# Altium schematic sheet Sheet1 - Copy.SchDoc
size A1
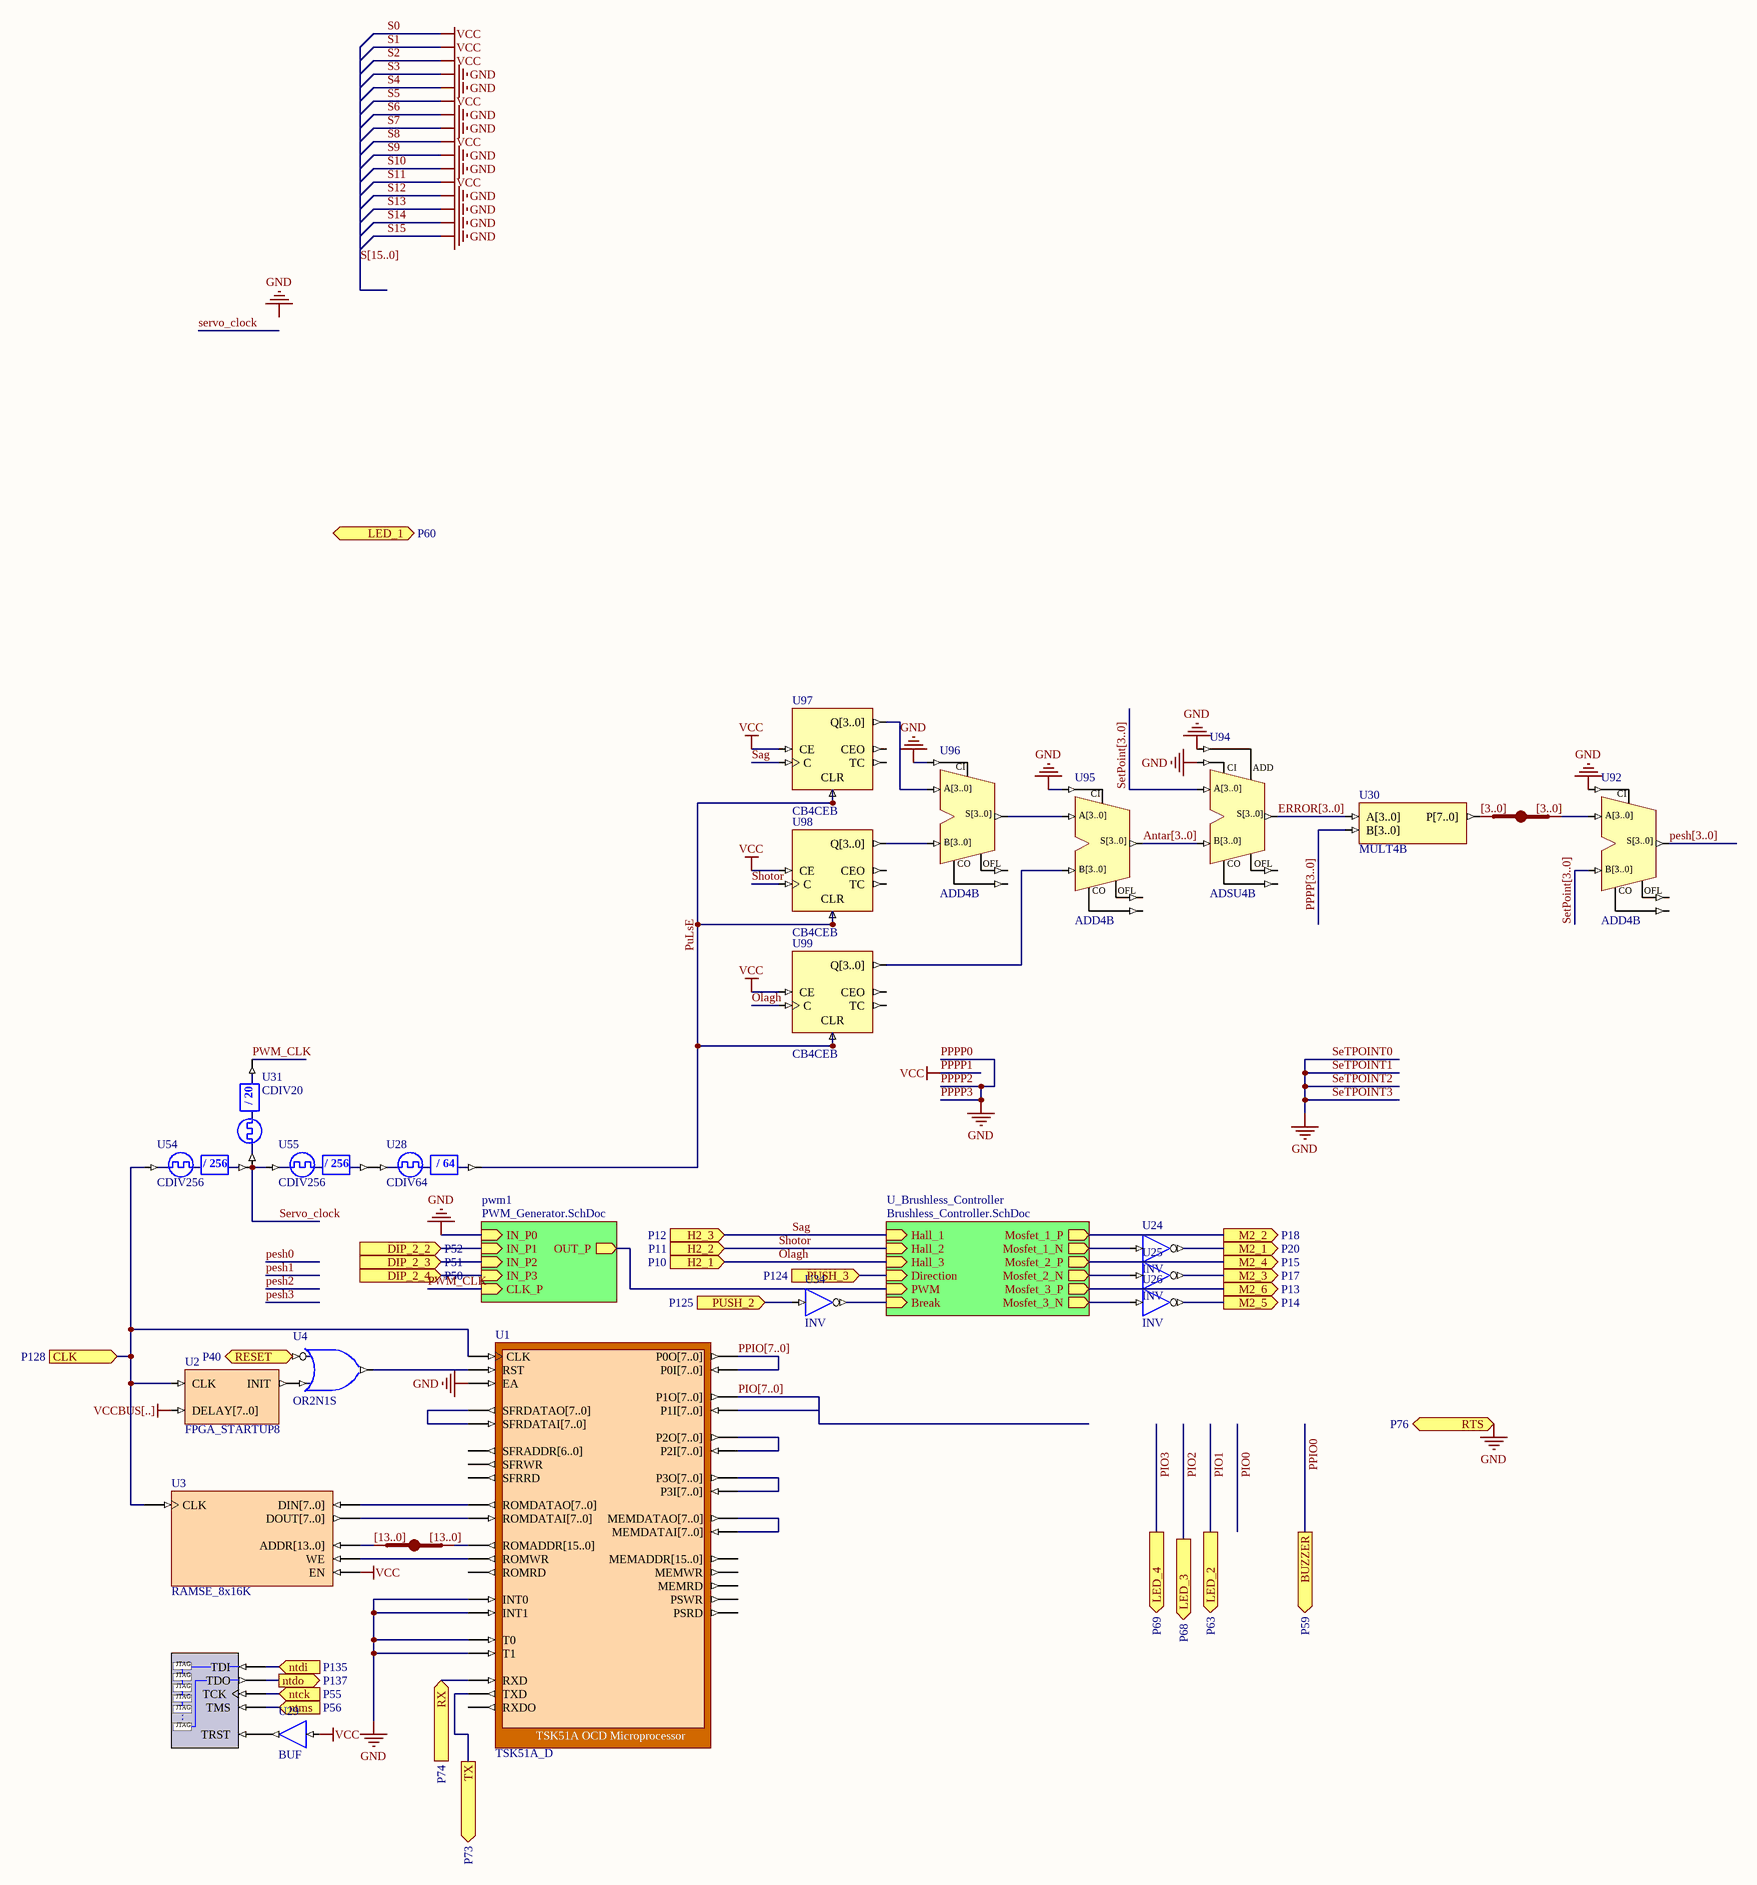
[diagram p0: Sheet1 - Copy.SchDoc]

## Parts
(Parts that share a designator on the sheet are numbered #1, #2 ... from top to bottom, then left to right.)
JB_AUTO?#1  IndexA: [3..0]  (hidden comment: JB)
JB_AUTO?#2  IndexA: [13..0]  (hidden comment: JB)
NEXUS_JTAG_PORT  NEXUS_JTAG_PORT  (value not drawn)
U1  TSK51A_D
U2  FPGA_STARTUP8
U3  RAMSE_8x16K
U4  OR2N1S
U24  INV
U25  INV
U26  INV
U28  CDIV64
U29  BUF
U30  MULT4B
U31  CDIV20
U34  INV
U54  CDIV256
U55  CDIV256
U92  ADD4B
U94  ADSU4B
U95  ADD4B
U96  ADD4B
U97  CB4CEB
U98  CB4CEB
U99  CB4CEB

## Sub-sheets
pwm1 = PWM_Generator.SchDoc: IN_P0 (in), IN_P1 (in), IN_P2 (in), IN_P3 (in), OUT_P (out), CLK_P (in)
U_Brushless_Controller = Brushless_Controller.SchDoc: Hall_1 (in), Hall_2 (in), Hall_3 (in), Direction (in), PWM (in), Mosfet_1_P (out), Mosfet_1_N (out), Mosfet_2_P (out), Mosfet_2_N (out), Mosfet_3_P (out), Mosfet_3_N (out), Break (in)

## Ports
BUZZER (out, see P59), CLK (in, see P128), DIP_2_2 (in, see P52), DIP_2_3 (in, see P51), DIP_2_4 (in, see P50), H2_1 (in, see P10), H2_2 (in, see P11), H2_3 (in, see P12), LED_1 (out, see P60), LED_2 (out, see P63), LED_3 (out, see P68), LED_4 (out, see P69), M2_1 (out, see P20), M2_2 (out, see P18), M2_3 (out, see P17), M2_4 (out, see P15), M2_5 (out, see P14), M2_6 (out, see P13), ntck (in, see P55), ntdi (in, see P135), ntdo (out, see P137), ntms (in, see P56), PUSH_2 (in, see P125), PUSH_3 (in, see P124), RESET (in, see P40), RTS (out, see P76), RX (in, see P74), TX (out, see P73)

## Nets
PPPP0: U1.EA U1.INT0 U1.INT1 U1.T0 U1.T1 U92.CI U94.ADD U94.CI U95.CI U96.CI ; port RTS, sheet pwm1/IN_P0  [also labelled GND, PPPP2, PPPP3, S10, S12, S13, S14, S15, S3, S4, S6, S7, S9, SeTPOINT0, SeTPOINT1, SeTPOINT2, SeTPOINT3]
PPPP1: U3.EN U29.I U97.CE U98.CE U99.CE  [also labelled S0, S1, S11, S2, S5, S8, VCC]
VCCBUS[..]: U2.DELAY[7..0]
Antar[3..0]: U94.B[3..0] U95.S[3..0]
CLK: U1.CLK U2.CLK U3.CLK U54.CLKIN ; port CLK
DIP_2_2: port DIP_2_2, sheet pwm1/IN_P1
DIP_2_3: port DIP_2_3, sheet pwm1/IN_P2
DIP_2_4: port DIP_2_4, sheet pwm1/IN_P3
ERROR[3..0]: U30.A[3..0] U94.S[3..0]
M2_1: U24.O ; port M2_1
M2_2: port M2_2, sheet U_Brushless_Controller/Mosfet_1_P
M2_3: U25.O ; port M2_3
M2_4: port M2_4, sheet U_Brushless_Controller/Mosfet_2_P
M2_5: U26.O ; port M2_5
M2_6: port M2_6, sheet U_Brushless_Controller/Mosfet_3_P
ntck: NEXUS_JTAG_PORT.TCK ; port ntck
ntdi: NEXUS_JTAG_PORT.TDI ; port ntdi
ntdo: NEXUS_JTAG_PORT.TDO ; port ntdo
ntms: NEXUS_JTAG_PORT.TMS ; port ntms
Olagh: U99.C ; port H2_1, sheet U_Brushless_Controller/Hall_3
pesh[3..0]: U92.S[3..0]
PIO1: port LED_2
PIO2: port LED_3
PIO3: port LED_4
PIO[7..0]: U1.P1I[7..0] U1.P1O[7..0]
PPIO0: port BUZZER
PPIO[7..0]: U1.P0I[7..0] U1.P0O[7..0]
PPPP[3..0]: U30.B[3..0]
PuLsE: U28.CLKDV U97.CLR U98.CLR U99.CLR
PUSH_2: U34.I ; port PUSH_2
PUSH_3: port PUSH_3, sheet U_Brushless_Controller/Direction
PWM_CLK: U31.CLKDV ; sheet pwm1/CLK_P
RESET: U4.I0 ; port RESET
RX: U1.RXD ; port RX
Sag: U97.C ; port H2_3, sheet U_Brushless_Controller/Hall_1
Servo_clock: U31.CLKIN U54.CLKDV U55.CLKIN
SetPoint[3..0]: U92.B[3..0] U94.A[3..0]
Shotor: U98.C ; port H2_2, sheet U_Brushless_Controller/Hall_2
TX: U1.TXD ; port TX
NetJB_AUTO?#1_A[0..0]: JB_AUTO?#1.A[0..0] U30.P[7..0]
NetJB_AUTO?#1_B[0..0]: JB_AUTO?#1.B[0..0] U92.A[3..0]
NetJB_AUTO?#2_A[0..0]: JB_AUTO?#2.A[0..0] U3.ADDR[13..0]
NetJB_AUTO?#2_B[0..0]: JB_AUTO?#2.B[0..0] U1.ROMADDR[15..0]
NetNEXUS_JTAG_PORT_TRST: NEXUS_JTAG_PORT.TRST U29.O
NetU1_MEMDATAI[7..0]: U1.MEMDATAI[7..0] U1.MEMDATAO[7..0]
NetU1_P2I[7..0]: U1.P2I[7..0] U1.P2O[7..0]
NetU1_P3I[7..0]: U1.P3I[7..0] U1.P3O[7..0]
NetU1_ROMDATAI[7..0]: U1.ROMDATAI[7..0] U3.DOUT[7..0]
NetU1_ROMDATAO[7..0]: U1.ROMDATAO[7..0] U3.DIN[7..0]
NetU1_ROMWR: U1.ROMWR U3.WE
NetU1_RST: U1.RST U4.O
NetU1_SFRDATAI[7..0]: U1.SFRDATAI[7..0] U1.SFRDATAO[7..0]
NetU2_INIT: U2.INIT U4.I1
NetU24_I: U24.I ; sheet U_Brushless_Controller/Mosfet_1_N
NetU25_I: U25.I ; sheet U_Brushless_Controller/Mosfet_2_N
NetU26_I: U26.I ; sheet U_Brushless_Controller/Mosfet_3_N
NetU28_CLKIN: U28.CLKIN U55.CLKDV
NetU34_O: U34.O ; sheet U_Brushless_Controller/Break
NetU95_A[3..0]: U95.A[3..0] U96.S[3..0]
NetU95_B[3..0]: U95.B[3..0] U99.Q[3..0]
NetU96_A[3..0]: U96.A[3..0] U97.Q[3..0]
NetU96_B[3..0]: U96.B[3..0] U98.Q[3..0]
(unnamed): sheet U_Brushless_Controller/PWM, sheet pwm1/OUT_P

Not connected (* = marked no-connect by the designer): U1 MEMADDR[15..0] MEMRD MEMWR PSRD PSWR ROMRD RXDO SFRADDR[6..0] SFRRD SFRWR; U92 CO OFL; U94 CO OFL; U95 CO OFL; U96 CO OFL; U97 CEO TC; U98 CEO TC; U99 CEO TC

## Buses and harness runs
bus Antar[3..0]
bus ERROR[3..0]
bus pesh[3..0]
bus PIO[7..0]
bus PPIO[7..0]
bus PPPP[3..0]
bus S[15..0]
bus SetPoint[3..0]

## Notes on the sheet
- Labels drawn without touching a wire or pin: GND
- (in symbol CDIV20) / 20
- (in symbol CDIV64) / 64
- (in symbol CDIV256) / 256
- (in symbol NEXUS_JTAG_PORT) .

## Library data of the parts
JB_AUTO?#1 JB_AUTO?#2 = JB: System BUS Joiner; Published: 29-Jan-2004; Publisher: Altium Limited; LastRevisionNo: 1.00.00; HelpURL: CR0118 FPGA Generic Library Guide.pdf#page=297; FunctionalClass: Bus Joiner
  JB_AUTO?#1: IndexB: [3..0]
  JB_AUTO?#2: IndexB: [13..0]
NEXUS_JTAG_PORT = NEXUS_JTAG_PORT: Soft Nexus-Chain Connector; NEXUS_JTAG_CONNECTOR: True; FunctionalClass: JTAG; Published: 29-Jan-2004; Publisher: Altium Limited; LastRevisionNo: 1.00.00; HelpURL: CR0118 FPGA Generic Library Guide.pdf#page=405
U1 = TSK51A_D: TSK51A OCD Microprocessor; NEXUS_CORE: Processor_OCDS; NEXUS_JTAG_DEVICE: True; NEXUS_JTAG_ORDER: 0; ChildModel1: RAM256x8_TSK51D; ChildCore1: U3; ChildModel2: RAM256x8_TSK51D_prim0; Published: 17-Nov-2004; Publisher: Altium Limited; ComponentLink1Description: Core &Resource Usage; ComponentLink1URL: CR0140 FPGA Processor Resource Usage.pdf#page=9; HelpURL: CR0115 TSK51x MCU.pdf; LastRevisionNo: 1.00.00; ComponentLink2Description: Embedded &Tools Guide; ComponentLink2URL: GU0107 Using the TSK51x TSK52x Embedded Tools.pdf; ComponentLink3Description: Embedded T&echnical References; ComponentLink3URL: TR0105 TSK51x TSK52x Embedded Tools Reference.pdf
U2 = FPGA_STARTUP8: FPGA Startup With 8 Bit Delay; Published: 9-Dec-2004; Publisher: Altium Limited; HelpURL: CR0119 FPGA_STARTUPx Powerup Delay Unit.pdf; LastRevisionNo: 1.00.00; ComponentLink1Description: Core &Resource Usage; ComponentLink1URL: CR0139 FPGA Peripheral Resource Usage.pdf#page=11
U3 = RAMSE_8x16K: Single Port RAM, Enable; Memory_Depth: 16384; Memory_Type: RAM_SinglePortBlock; Memory_Width: 8; Memory_ClockEdge: Rising; Nexus_Core: Memory_Program; Memory_EnablePin: True; Memory_ByteWrites: False; Published: 11/10/2004; Publisher: Altium Hobart Technology Center
U4 = OR2B1: 2-Input OR Gate with Active Low A Input, Single Pin Version; XilinxEquivalent: OR2B1; FunctionalClass: Logic Primitive; PortSize: 2; ArchiveName: GENERIC; VHDLIB_SIM: GENERIC_LIB; Published: 29-Jan-2004; Publisher: Altium Limited; LastRevisionNo: 1.00.00; HelpURL: CR0118 FPGA Generic Library Guide.pdf#page=410; ComponentLink1URL: CR0136 FPGA Logic Primitive Resource Usage.pdf#page=187; ComponentLink1Description: Core &Resource Usage; SubClass: OR; PortStyle: Single Pin Version
U24-U26 U34 = INV: Inverter; FunctionalClass: Logic Primitive; ArchiveName: GENERIC; VHDLIB_SIM: GENERIC_LIB; Published: 29-Jan-2004; Publisher: Altium Limited; XilinxEquivalent: INV; LastRevisionNo: 1.00.00; HelpURL: CR0118 FPGA Generic Library Guide.pdf#page=291; ComponentLink1URL: CR0136 FPGA Logic Primitive Resource Usage.pdf#page=61; ComponentLink1Description: Core &Resource Usage; SubClass: INV
U28 = CDIV64: Clock Divider by 64; DivisorRate: 64; ArchiveName: GENERIC; VHDLIB_SIM: GENERIC_LIB; Published: 29-Jan-2004; Publisher: Altium Limited; LastRevisionNo: 1.00.00; HelpURL: CR0118 FPGA Generic Library Guide.pdf#page=142; ComponentLink1URL: CR0127 FPGA Clock Divider Resource Usage.pdf#page=26; ComponentLink1Description: Core &Resource Usage; FunctionalClass: Clock Divider
U29 = BUF: 1-bit General Purpose (Non-inverting) Buffer; ArchiveName: GENERIC; VHDLIB_SIM: GENERIC_LIB; Published: 29-Jan-2004; Publisher: Altium Limited; XilinxEquivalent: BUF; LastRevisionNo: 1.00.00; HelpURL: CR0118 FPGA Generic Library Guide.pdf#page=122; ComponentLink1URL: CR0125 FPGA Buffer Resource Usage.pdf#page=3; ComponentLink1Description: Core &Resource Usage; FunctionalClass: Buffer; SubClass: BUF
U30 = MULT4B: 4x4 Signed Multiplier, Bus Version; FunctionalClass: Arithmetic Function; SubClass: MULT; PortSize: 4; ArchiveName: GENERIC; VHDLIB_SIM: GENERIC_LIB; Published: 29-Jan-2004; Publisher: Altium Limited; LastRevisionNo: 1.00.00; HelpURL: CR0118 FPGA Generic Library Guide.pdf#page=398; ComponentLink1URL: CR0124 FPGA Arithmetic Function Resource Usage.pdf#page=59; ComponentLink1Description: Core &Resource Usage; PortStyle: Bus Version
U31 = CDIV20: Clock Divider by 20; DivisorRate: 20; ArchiveName: GENERIC; VHDLIB_SIM: GENERIC_LIB; Published: 29-Jan-2004; Publisher: Altium Limited; LastRevisionNo: 1.00.00; HelpURL: CR0118 FPGA Generic Library Guide.pdf#page=142; ComponentLink1URL: CR0127 FPGA Clock Divider Resource Usage.pdf#page=20; ComponentLink1Description: Core &Resource Usage; FunctionalClass: Clock Divider
U54 U55 = CDIV256: Clock Divider by 256; DivisorRate: 256; ArchiveName: GENERIC; VHDLIB_SIM: GENERIC_LIB; Published: 29-Jan-2004; Publisher: Altium Limited; LastRevisionNo: 1.00.00; HelpURL: CR0118 FPGA Generic Library Guide.pdf#page=142; ComponentLink1URL: CR0127 FPGA Clock Divider Resource Usage.pdf#page=30; ComponentLink1Description: Core &Resource Usage; FunctionalClass: Clock Divider
U92 U95 U96 = ADD4B: 4-Bit Cascadable Full Adder with Signed and Unsigned Operations, Bus Version; FunctionalClass: Arithmetic Function; SubClass: ADD; PortSize: 4; ArchiveName: GENERIC; VHDLIB_SIM: GENERIC_LIB; Published: 29-Jan-2004; Publisher: Altium Limited; LastRevisionNo: 1.00.00; HelpURL: CR0118 FPGA Generic Library Guide.pdf#page=98; ComponentLink1URL: CR0124 FPGA Arithmetic Function Resource Usage.pdf#page=14; ComponentLink1Description: Core &Resource Usage; PortStyle: Bus Version
U94 = ADSU4B: 4-Bit Cascadable Full Adder/Subtracter with Signed and Unsigned Operations, Bus Version; FunctionalClass: Arithmetic Function; SubClass: ADSU; PortSize: 4; ArchiveName: GENERIC; VHDLIB_SIM: GENERIC_LIB; Published: 29-Jan-2004; Publisher: Altium Limited; LastRevisionNo: 1.00.00; HelpURL: CR0118 FPGA Generic Library Guide.pdf#page=107; ComponentLink1URL: CR0124 FPGA Arithmetic Function Resource Usage.pdf#page=44; ComponentLink1Description: Core &Resource Usage; PortStyle: Bus Version
U97-U99 = CB4CEB: 4-Bit Cascadable Binary Counters with Clock Enable and Asynchronous Clear, Bus Version; ClockTrigger: Rising; Enable: High; PortSize: 4; ArchiveName: GENERIC; VHDLIB_SIM: GENERIC_LIB; Published: 29-Jan-2004; Publisher: Altium Limited; LastRevisionNo: 1.00.00; HelpURL: CR0118 FPGA Generic Library Guide.pdf#page=128; ComponentLink1URL: CR0130 FPGA Counter Resource Usage.pdf#page=13; ComponentLink1Description: Core &Resource Usage; FunctionalClass: Counter; SubClass: Binary; Reset: Asynchronous; PortType: Bus Version